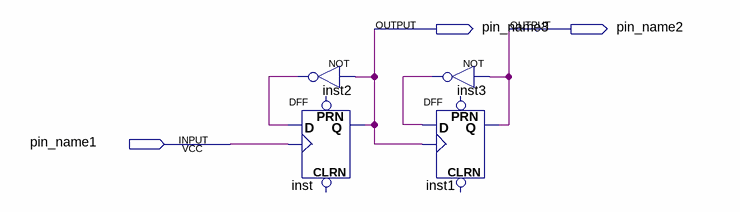
[diagram p0: schematic sheet]
// Quartus schematic ClockDivider.bdf as structural Verilog: 4 symbols, 3 pins
module ClockDivider (
  input  pin_name1,
  output pin_name3,
  output pin_name2
);

  wire inst2_out, inst3_out;

  not inst2 (inst2_out, pin_name3);
  DFF inst (.CLK(pin_name1), .D(inst2_out), .Q(pin_name3));  // open: CLRN, PRN
  not inst3 (inst3_out, pin_name2);
  DFF inst1 (.CLK(pin_name3), .D(inst3_out), .Q(pin_name2));  // open: CLRN, PRN
endmodule
